# Altium project PCB_Project.PrjPcb
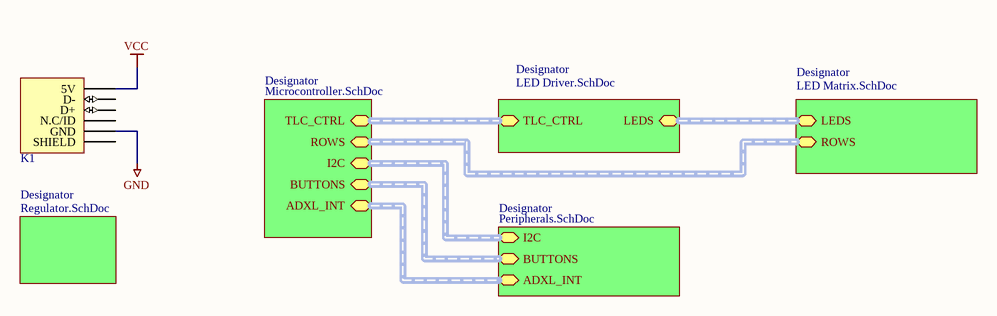
[diagram p0: RGB_Matrix.SchDoc]
3 sheets, 18 parts. Net scope: hierarchical (ports join the sheet entries above them; power ports are global).
Sheets:
  RGB_Matrix.SchDoc
    Designator = Microcontroller.SchDoc
    Designator = Peripherals.SchDoc

## Sheet RGB_Matrix.SchDoc
size A

### Parts
K1  USB_CONNECTOR_5P  [USB_MINI_SMD]  (value not drawn)

### Sub-sheets
Designator = LED Matrix.SchDoc (file not in this document): LEDS (harness LEDS), ROWS (harness ROWS)
Designator = LED Driver.SchDoc (file not in this document): TLC_CTRL (harness TLC_CTRL), LEDS (harness LEDS)
Designator = Microcontroller.SchDoc: TLC_CTRL (harness TLC_CTRL), ROWS (harness ROWS), I2C (harness I2C), ADXL_INT (harness ADXL_INT), BUTTONS (harness BUTTONS)
Designator = Regulator.SchDoc (file not in this document): no entries
Designator = Peripherals.SchDoc: I2C (harness I2C), ADXL_INT (harness ADXL_INT), BUTTONS (harness BUTTONS)

### Nets
GND: K1.5(GND)
VCC: K1.1(5V)

Not connected (* = marked no-connect by the designer): K1 0(SHIELD) 2(D-) 3(D+) 4(N.C/ID)

### Library data of the parts
K1 = 1753: KONTAKT, SMD; id: 1753; rad: 11; rom: OV; lager_type: Fremlager; dybde: 1; hylle: 6; antall: 200; pakke_opprettet_av: 924; navn: USB mini; pris: 8; nokkelord: USB, USB mini, kontakt, SMD; kolonne: 1; pakke_opprettet: 30-Jul-15 6:08:19 PM; symbol_opprettet_av: 924; symbol_opprettet: 30-Jul-15 6:06:06 PM; pakketype: SMD

## Sheet Microcontroller.SchDoc
size A4
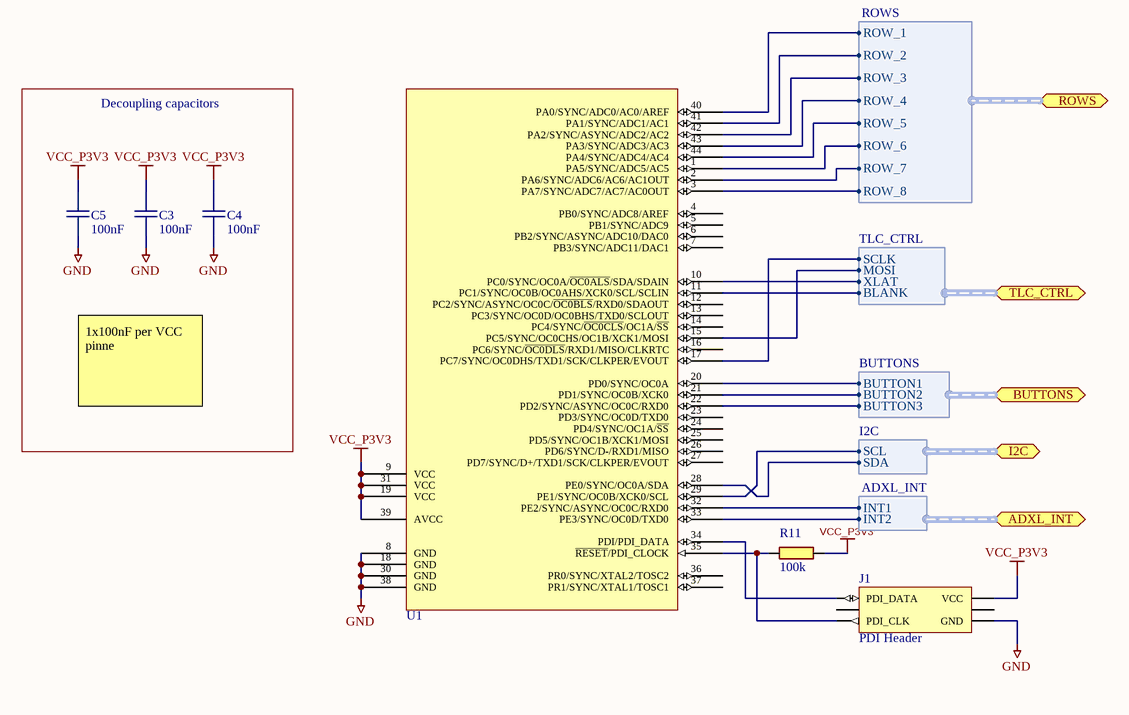
[diagram p1: Microcontroller.SchDoc]

### Parts
C3  100nF  [CAPC0805(2012)100_N]
C4  100nF  [CAPC0805(2012)100_N]
C5  100nF  [CAPC0805(2012)100_N]
J1  PDI Header  [HEADER_3x2]
R11  100k  [RESC0603(1608)_N]
U1  ATXMEGA-A4U  [TQFP80P1200X1200X120-44N]  (value not drawn)

### Blocks framed on the sheet
Decoupling capacitors: C3-C5

### Ports
ADXL_INT (harness ADXL_INT), BUTTONS (harness BUTTONS), I2C (harness I2C), ROWS (harness ROWS), TLC_CTRL (harness TLC_CTRL)

### Harnesses
ROWS: ROW_1, ROW_2, ROW_3, ROW_4, ROW_5, ROW_6, ROW_7, ROW_8
TLC_CTRL: SCLK, MOSI, XLAT, BLANK
I2C: SCL, SDA
ADXL_INT: INT1, INT2
BUTTONS: BUTTON1, BUTTON2, BUTTON3

### Nets
GND: C3.1 C4.1 C5.1 J1.6(GND) U1.8(GND) U1.18(GND) U1.30(GND) U1.38(GND)
VCC_P3V3: C3.2 C4.2 C5.2 J1.2(VCC) R11.1 U1.9(VCC) U1.19(VCC) U1.31(VCC) U1.39(AVCC)
NetJ1_1: J1.1(PDI_DATA) U1.34(PDI/PDI_DATA)
NetJ1_5: J1.5(PDI_CLK) R11.2 U1.35(~{RESET}/PDI_CLOCK)
NetJ2_2: U1.20(PD0/SYNC/OC0A) ; port BUTTONS.BUTTON1
NetR12_1: U1.29(PE1/SYNC/OC0B/XCK0/SCL) ; port I2C.SCL
NetR13_1: U1.28(PE0/SYNC/OC0A/SDA) ; port I2C.SDA
NetR14_1: U1.21(PD1/SYNC/OC0B/XCK0) ; port BUTTONS.BUTTON2
NetR15_1: U1.22(PD2/SYNC/ASYNC/OC0C/RXD0) ; port BUTTONS.BUTTON3
NetU1_1: U1.1(PA5/SYNC/ADC5/AC5) ; port ROWS.ROW_6
NetU1_2: U1.2(PA6/SYNC/ADC6/AC6/AC1OUT) ; port ROWS.ROW_7
NetU1_3: U1.3(PA7/SYNC/ADC7/AC7/AC0OUT) ; port ROWS.ROW_8
NetU1_10: U1.10(PC0/SYNC/OC0A/~{OC0ALS}/SDA/SDAIN) ; port TLC_CTRL.XLAT
NetU1_11: U1.11(PC1/SYNC/OC0B/OC0AHS/XCK0/SCL/SCLIN) ; port TLC_CTRL.BLANK
NetU1_15: U1.15(PC5/SYNC/OC0CHS/OC1B/XCK1/MOSI) ; port TLC_CTRL.MOSI
NetU1_17: U1.17(PC7/SYNC/OC0DHS/TXD1/SCK/CLKPER/EVOUT) ; port TLC_CTRL.SCLK
NetU1_32: U1.32(PE2/SYNC/ASYNC/OC0C/RXD0) ; port ADXL_INT.INT1
NetU1_33: U1.33(PE3/SYNC/OC0D/TXD0) ; port ADXL_INT.INT2
NetU1_40: U1.40(PA0/SYNC/ADC0/AC0/AREF) ; port ROWS.ROW_1
NetU1_41: U1.41(PA1/SYNC/ADC1/AC1) ; port ROWS.ROW_2
NetU1_42: U1.42(PA2/SYNC/ASYNC/ADC2/AC2) ; port ROWS.ROW_3
NetU1_43: U1.43(PA3/SYNC/ADC3/AC3) ; port ROWS.ROW_4
NetU1_44: U1.44(PA4/SYNC/ADC4/AC4) ; port ROWS.ROW_5

Not connected (* = marked no-connect by the designer): J1 3 4; U1 4(PB0/SYNC/ADC8/AREF) 5(PB1/SYNC/ADC9) 6(PB2/SYNC/ASYNC/ADC10/DAC0) 7(PB3/SYNC/ADC11/DAC1) 12(PC2/SYNC/ASYNC/OC0C/~{OC0BLS}/RXD0/SDAOUT) 13(PC3/SYNC/OC0D/OC0BHS/TXD0/SCLOUT) 14(PC4/SYNC/~{OC0CLS}/OC1A/~{SS}) 16(PC6/SYNC/~{OC0DLS}/RXD1/MISO/CLKRTC) 23(PD3/SYNC/OC0D/TXD0) 24(PD4/SYNC/OC1A/~{SS}) 25(PD5/SYNC/OC1B/XCK1/MOSI) 26(PD6/SYNC/D-/RXD1/MISO) 27(PD7/SYNC/D+/TXD1/SCK/CLKPER/EVOUT) 36(PR0/SYNC/XTAL2/TOSC2) 37(PR1/SYNC/XTAL1/TOSC1)

### Notes on the sheet
- 1x100nF per VCC pinne

### Library data of the parts
C3-C5 = 2445: X7R 50V; id: 2445; rad: 1; rom: OV; lager_type: Fremlager; dybde: 4; hylle: 13; antall: 50; kolonne: 3; pakke_opprettet_av: 815; leverandor_varenr: 2408556; nokkelord: Kondensator, capacitor; produsent: Multikomp; leverandor: Farnell; pakketype: 0805; pakke_opprettet: 11/14/2014 8:52:01 PM; symbol_opprettet_av: 815; symbol_opprettet: 11/14/2014 8:19:34 PM; navn: 100nF; pris: 1
J1 = 2407: PDI Xmega programming header; id: 2407
R11 = 2384: 0.1W 1% Thick film resistor; id: 2384; rad: -1; rom: OV; lager_type: Fremlager; dybde: 96; hylle: 6; antall: 100; kolonne: 0; pakke_opprettet_av: 815; pakketype: 0603; pakke_opprettet: 08.07.2014 21:15:30; symbol_opprettet_av: 815; symbol_opprettet: 08.07.2014 21:16:33; navn: 100k; pris: 0; nokkelord: Resistor
U1 = 2103: id: 2103; rad: 4; rom: OV; lager_type: Fremlager; dybde: 0; antall: 82; kolonne: 2; pakke_opprettet_av: 774; beskrivelse: Mikrokontroller; navn: ATXMEGA64A4U-AU; produsent: Atmel; pakketype: TQFP; hylle: 0; pakke_opprettet: 8/22/2014 2:00:28 PM; symbol_opprettet_av: 774; symbol_opprettet: 8/22/2014 2:00:55 PM; pris: 0

## Sheet Peripherals.SchDoc
size A
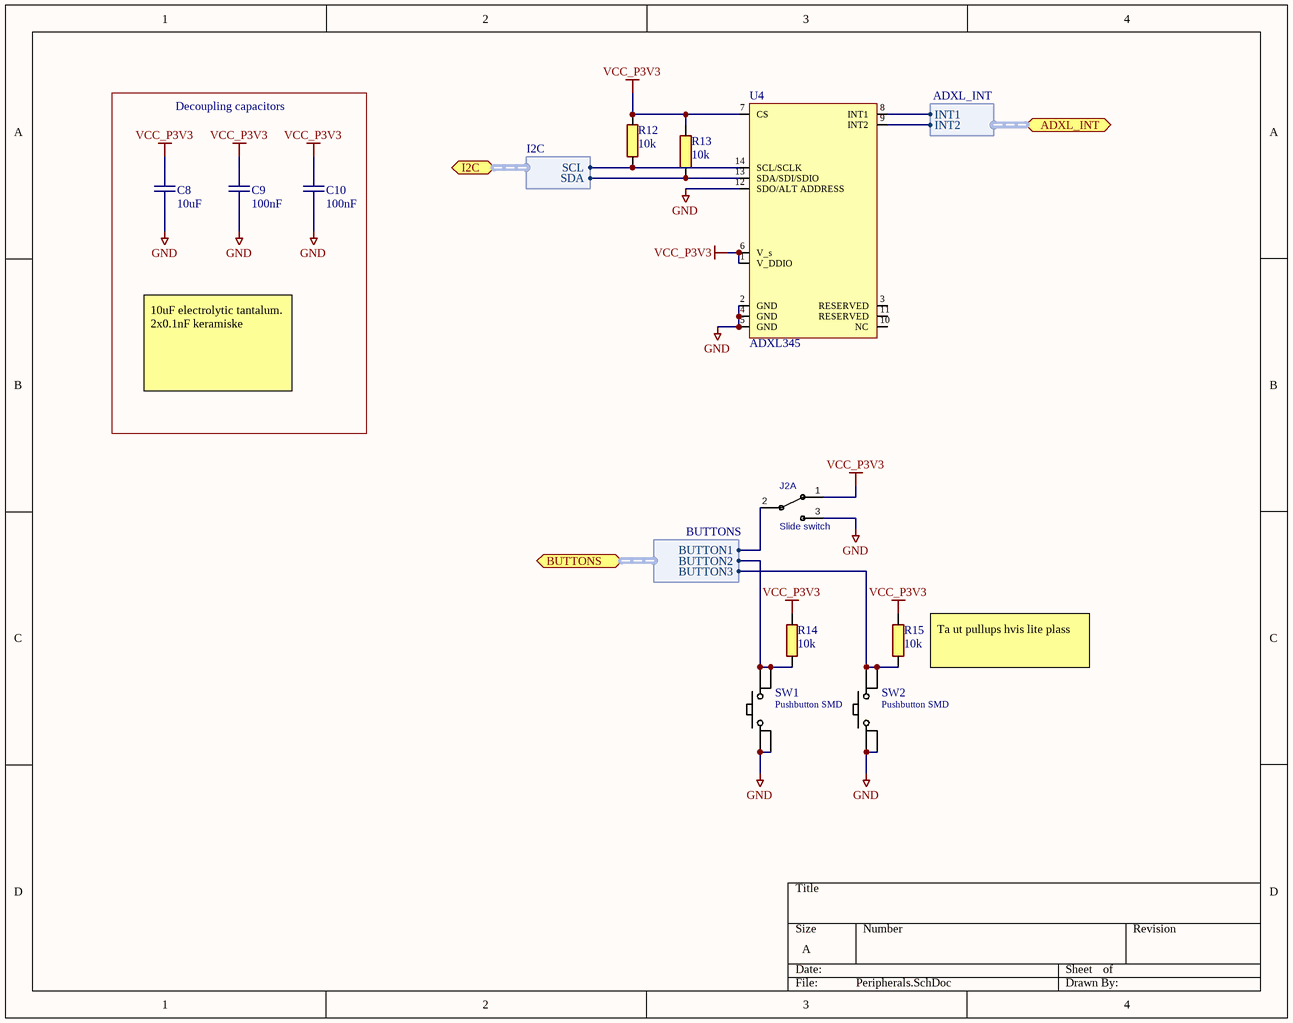
[diagram p2: Peripherals.SchDoc]

### Parts
C8  10uF  [CAPC1206(3216)170_N]
C9  100nF  [CAPC0603(1608)55_N]
C10  100nF  [CAPC0603(1608)55_N]
J2  Slide switch  [OS202011MA0QS1]  (part A of 2)
R12  10k  [RESC0603(1608)_N]
R13  10k  [RESC0603(1608)_N]
R14  10k  [RESC0603(1608)_N]
R15  10k  [RESC0603(1608)_N]
SW1  Pushbutton SMD  [SOIC254P500X160-4]
SW2  Pushbutton SMD  [SOIC254P500X160-4]
U4  ADXL345

### Blocks framed on the sheet
Decoupling capacitors: C8-C10

### Ports
ADXL_INT (harness ADXL_INT), BUTTONS (harness BUTTONS), I2C (harness I2C)

### Harnesses
I2C: SCL, SDA
BUTTONS: BUTTON1, BUTTON2, BUTTON3
ADXL_INT: INT1, INT2

### Nets
GND: C8.1 C9.1 C10.1 J2.3 SW1.1 SW1.2 SW2.1 SW2.2 U4.2(GND) U4.4(GND) U4.5(GND) U4.12(SDO/ALT_ADDRESS)
VCC_P3V3: C8.2 C9.2 C10.2 J2.1 R12.2 R13.2 R14.2 R15.2 U4.1(V_DDIO) U4.6(V_s) U4.7(CS)
NetJ2_2: J2.2 ; port BUTTONS.BUTTON1
NetR12_1: R12.1 U4.14(SCL/SCLK) ; port I2C.SCL
NetR13_1: R13.1 U4.13(SDA/SDI/SDIO) ; port I2C.SDA
NetR14_1: R14.1 SW1.3 SW1.4 ; port BUTTONS.BUTTON2
NetR15_1: R15.1 SW2.3 SW2.4 ; port BUTTONS.BUTTON3
NetU1_32: U4.8(INT1) ; port ADXL_INT.INT1
NetU1_33: U4.9(INT2) ; port ADXL_INT.INT2

Not connected (* = marked no-connect by the designer): U4 3(RESERVED) 10(NC) 11(RESERVED)

### Notes on the sheet
- 10uF electrolytic tantalum.
  2x0.1nF keramiske
- (near R15) Ta ut pullups hvis lite plass

### Library data of the parts
C8 = 3583: X5R 50V 10%; id: 3583; pakke_opprettet_av: 815; leverandor_varenr: 1845762; pris: 6; nokkelord: Kondensator, capacitor; produsent: Murata; leverandor: Farnell; pakketype: 1206; pakke_opprettet: 11-Feb-15 1:21:22 PM; symbol_opprettet_av: 815; symbol_opprettet: 14-Nov-14 8:19:34 PM; navn: 10uF
C9 C10 = 3028: X7R 50V 5%; id: 3028; pakke_opprettet_av: 815; leverandor_varenr: 1759122; pris: 1; nokkelord: Kondensator, Capacitor, CAP; produsent: Multikomp; leverandor: Farnell; pakketype: 0603; pakke_opprettet: 18-Feb-15 2:18:13 PM; symbol_opprettet_av: 815; symbol_opprettet: 14-Nov-14 8:19:34 PM; navn: 100nF
J2 = 4031: Vinklet; id: 4031; pakke_opprettet_av: 1335; leverandor_varenr: 2435101; navn: Bryter DPDT; pris: 0; nokkelord: right angle slide switch; leverandor: Farnell; pakketype: TH; pakke_opprettet: 20-Feb-17 6:08:34 PM; symbol_opprettet_av: 1335; symbol_opprettet: 20-Feb-17 6:08:19 PM
R12-R15 = 2444: 0.1W 1% Thick film resistor; id: 2444; rad: -1; rom: OV; lager_type: Fremlager; dybde: 72; hylle: 6; antall: 90; kolonne: 0; pakke_opprettet_av: 815; leverandor_varenr: 2447230; nokkelord: Resistor Motstand; produsent: Multikomp; leverandor: Farnell; pakketype: 0603; pakke_opprettet: 08-Jul-14 9:15:30 PM; symbol_opprettet_av: 815; symbol_opprettet: 08-Jul-14 9:16:33 PM; navn: 10k; pris: 0
SW1 SW2 = 2413: id: 2413; rad: 5; rom: OV; lager_type: Fremlager; dybde: 1; hylle: 6; antall: 100; pakke_opprettet_av: 815; beskrivelse: Momentary tactile pushbutton SMD; pris: 2; nokkelord: smd, tactile, pushbutton, knapp, smd; kolonne: 1; pakke_opprettet: 14-Nov-14 10:12:31 PM; symbol_opprettet_av: 815; symbol_opprettet: 14-Nov-14 9:57:30 PM; navn: Pushbutton SMD; pakketype: SMD

## Nets that join several sheets
GND: RGB_Matrix (K1.5), Microcontroller (8 pins), Peripherals (12 pins)
VCC_P3V3: Microcontroller (9 pins), Peripherals (11 pins)
NetJ2_2: Microcontroller (U1.20), Peripherals (J2.2)
NetR12_1: Microcontroller (U1.29), Peripherals (R12.1 U4.14)
NetR13_1: Microcontroller (U1.28), Peripherals (R13.1 U4.13)
NetR14_1: Microcontroller (U1.21), Peripherals (R14.1 SW1.3 SW1.4)
NetR15_1: Microcontroller (U1.22), Peripherals (R15.1 SW2.3 SW2.4)
NetU1_32: Microcontroller (U1.32), Peripherals (U4.8)
NetU1_33: Microcontroller (U1.33), Peripherals (U4.9)

## Assembly variants
Default assembly: not fitted C?